# EAGLE design Driver_Led_final (EAGLE 9.6.2)
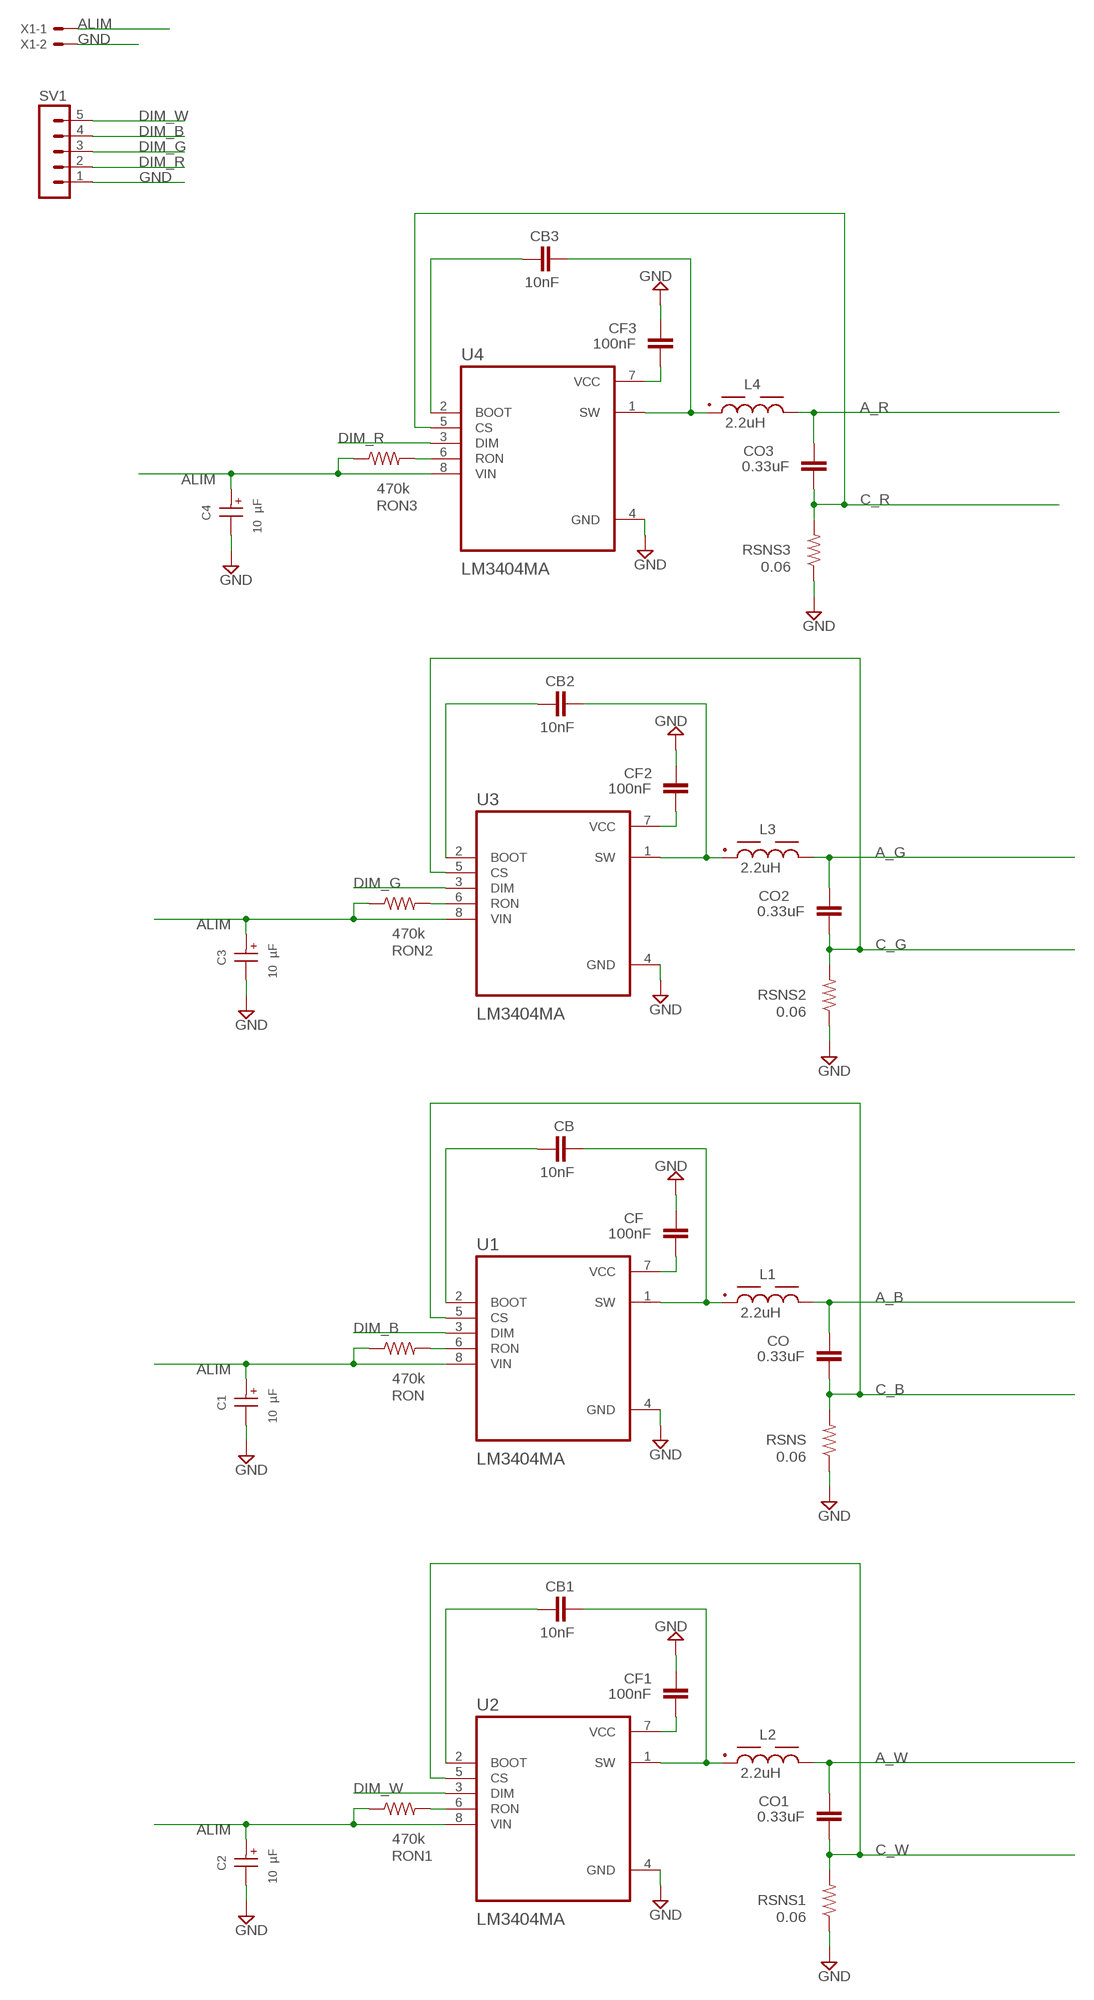
[diagram p0: schematic, sheet 1, part 1 of 2]
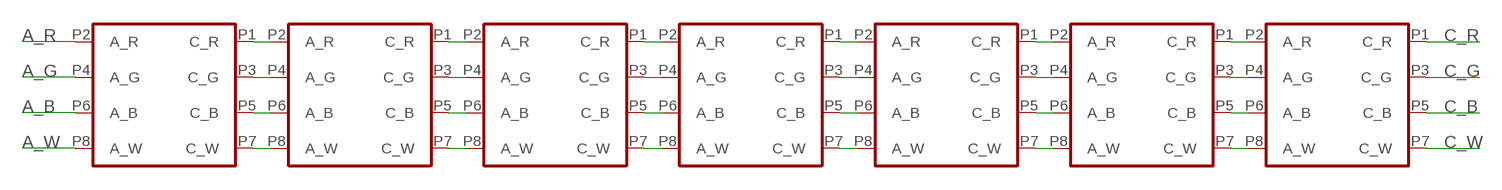
[diagram p1: schematic, sheet 1, part 2 of 2]

## Parts
C1  10 µF  WCAP-ASLL_4X5.5_865060440001  [WCAP-ASLL_4X5.5(DXL)]
C2  10 µF  WCAP-ASLL_4X5.5_865060440001  [WCAP-ASLL_4X5.5(DXL)]
C3  10 µF  WCAP-ASLL_4X5.5_865060440001  [WCAP-ASLL_4X5.5(DXL)]
C4  10 µF  WCAP-ASLL_4X5.5_865060440001  [WCAP-ASLL_4X5.5(DXL)]
CB  10nF  C-EUC0603  [C0603]
CB1  10nF  C-EUC0603  [C0603]
CB2  10nF  C-EUC0603  [C0603]
CB3  10nF  C-EUC0603  [C0603]
CF  100nF  C-EUC0603  [C0603]
CF1  100nF  C-EUC0603  [C0603]
CF2  100nF  C-EUC0603  [C0603]
CF3  100nF  C-EUC0603  [C0603]
CO  0.33uF  C-EUC0603  [C0603]
CO1  0.33uF  C-EUC0603  [C0603]
CO2  0.33uF  C-EUC0603  [C0603]
CO3  0.33uF  C-EUC0603  [C0603]
L1  2.2uH  WE-PDA_1260_784771022  [WE-PDA_1260]
L2  2.2uH  WE-PDA_1260_784771022  [WE-PDA_1260]
L3  2.2uH  WE-PDA_1260_784771022  [WE-PDA_1260]
L4  2.2uH  WE-PDA_1260_784771022  [WE-PDA_1260]
RON  470k  R-US_R0603  [R0603]
RON1  470k  R-US_R0603  [R0603]
RON2  470k  R-US_R0603  [R0603]
RON3  470k  R-US_R0603  [R0603]
RSNS  0.06  R-US_R0603  [R0603]
RSNS1  0.06  R-US_R0603  [R0603]
RSNS2  0.06  R-US_R0603  [R0603]
RSNS3  0.06  R-US_R0603  [R0603]
SV1  MA05-1  [MA05-1]
U1  LM3404MA  [SOIC127P599X175-8N]
U2  LM3404MA  [SOIC127P599X175-8N]
U3  LM3404MA  [SOIC127P599X175-8N]
U4  LM3404MA  [SOIC127P599X175-8N]
U$1  LE_RTDUW_S2WM_DEVICE  [LE_RTDUW_S2WM_FOOTPRINT]
U$2  LE_RTDUW_S2WM_DEVICE  [LE_RTDUW_S2WM_FOOTPRINT]
U$3  LE_RTDUW_S2WM_DEVICE  [LE_RTDUW_S2WM_FOOTPRINT]
U$4  LE_RTDUW_S2WM_DEVICE  [LE_RTDUW_S2WM_FOOTPRINT]
U$5  LE_RTDUW_S2WM_DEVICE  [LE_RTDUW_S2WM_FOOTPRINT]
U$6  LE_RTDUW_S2WM_DEVICE  [LE_RTDUW_S2WM_FOOTPRINT]
U$7  LE_RTDUW_S2WM_DEVICE  [LE_RTDUW_S2WM_FOOTPRINT]
X1  22-23-2021  [22-23-2021]

## Nets
A_B: CO.2 L1.2 U$1.P6(A_B)
A_G: CO2.2 L3.2 U$1.P4(A_G)
A_R: CO3.2 L4.2 U$1.P2(A_R)
A_W: CO1.2 L2.2 U$1.P8(A_W)
ALIM: C1.1(+) C2.1(+) C3.1(+) C4.1(+) RON1.1 RON2.1 RON3.1 RON.1 U1.8(VIN) U2.8(VIN) U3.8(VIN) U4.8(VIN) X1.1
C_B: CO.1 RSNS.2 U1.5(CS) U$7.P5(C_B)
C_G: CO2.1 RSNS2.2 U3.5(CS) U$7.P3(C_G)
C_R: CO3.1 RSNS3.2 U4.5(CS) U$7.P1(C_R)
C_W: CO1.1 RSNS1.2 U2.5(CS) U$7.P7(C_W)
DIM_B: SV1.4 U1.3(DIM)
DIM_G: SV1.3 U3.3(DIM)
DIM_R: SV1.2 U4.3(DIM)
DIM_W: SV1.5 U2.3(DIM)
GND: C1.2(-) C2.2(-) C3.2(-) C4.2(-) CF1.1 CF2.1 CF3.1 CF.1 RSNS1.1 RSNS2.1 RSNS3.1 RSNS.1 SV1.1 U1.4(GND) U2.4(GND) U3.4(GND) U4.4(GND) X1.2
N$1: RON.2 U1.6(RON)
N$2: CB1.1 U2.2(BOOT)
N$3: CF.2 U1.7(VCC)
N$4: CB.1 U1.2(BOOT)
N$5: CB.2 L1.1 U1.1(SW)
N$6: CB1.2 L2.1 U2.1(SW)
N$7: CF1.2 U2.7(VCC)
N$8: RON1.2 U2.6(RON)
N$9: CB2.1 U3.2(BOOT)
N$10: CB2.2 L3.1 U3.1(SW)
N$11: CF2.2 U3.7(VCC)
N$12: RON2.2 U3.6(RON)
N$13: CB3.1 U4.2(BOOT)
N$14: CB3.2 L4.1 U4.1(SW)
N$15: CF3.2 U4.7(VCC)
N$16: RON3.2 U4.6(RON)
N$17: U$1.P1(C_R) U$2.P2(A_R)
N$18: U$1.P3(C_G) U$2.P4(A_G)
N$19: U$1.P5(C_B) U$2.P6(A_B)
N$20: U$1.P7(C_W) U$2.P8(A_W)
N$21: U$2.P1(C_R) U$3.P2(A_R)
N$22: U$2.P3(C_G) U$3.P4(A_G)
N$23: U$2.P5(C_B) U$3.P6(A_B)
N$24: U$2.P7(C_W) U$3.P8(A_W)
N$25: U$3.P7(C_W) U$4.P8(A_W)
N$26: U$3.P5(C_B) U$4.P6(A_B)
N$27: U$3.P3(C_G) U$4.P4(A_G)
N$28: U$3.P1(C_R) U$4.P2(A_R)
N$29: U$4.P1(C_R) U$5.P2(A_R)
N$30: U$4.P3(C_G) U$5.P4(A_G)
N$31: U$4.P5(C_B) U$5.P6(A_B)
N$32: U$4.P7(C_W) U$5.P8(A_W)
N$33: U$5.P1(C_R) U$6.P2(A_R)
N$34: U$5.P3(C_G) U$6.P4(A_G)
N$35: U$5.P5(C_B) U$6.P6(A_B)
N$36: U$5.P7(C_W) U$6.P8(A_W)
N$37: U$6.P1(C_R) U$7.P2(A_R)
N$38: U$6.P3(C_G) U$7.P4(A_G)
N$39: U$6.P5(C_B) U$7.P6(A_B)
N$40: U$6.P7(C_W) U$7.P8(A_W)

## Library data of the parts
C1-C4 = Eagle_WCAP-ASLL (rev20a):WCAP-ASLL_4X5.5: WCAP-ASLL Aluminium Electrolytic Capacitors Low Impedance & Long Life +105 °C Characteristics Low impedance and long life product series Mounting style: V-Chip SMT Capacitance range: 1 µF ‒ 6800 µF Capacitance tolerance: ±20 % Voltage range (UR): 6.3 ‒ 450 V(DC) Operating temperature: -55 °C up to +105 °C for UR ≤ 100 V(DC) -40 °C up to +105 °C for UR > 100 V(DC) Endurance: 2000 ‒ 5000 h @ +105 °C Dimensions (DxL) in mm: 4.0 x 5.5 up to 16.0 x 17.0 Recommended soldering: Reflow soldering Applications Long life application & low impedance Input and output capacitor for switched-mode power supply Filtering Smoothing e.g. DC/DC converter, AC/DC converter, satellite receiver, control panel <https://www.we-online.com/catalog/media/o14724v209%20Family_WCAP-ASLL.jpg> Details see: https://www.we-online.com/catalog/en/WCAP-ASLL/ Updated by yingchun,Shan;2020-03-03 2020(C) Würth Elektronik; DATASHEET-URL: https://www.we-online.com/catalog/datasheet/865060440001.pdf; DF: 14%; DIAMETER: 4mm; I-LEAK: 3uA; I-RIPPLE: 90mA; L: 5.5mm; OPERATING-TEMPERATURE: -55 °C up to +105 °C; PART-NUMBER: 865060440001; TECHNICAL-REFERENCE: ASEB055100M025DVCTAB000; VR: 25V(DC); Z: 1.35Ohm
CB CB1-CB3 CF CF1-CF3 CO CO1-CO3 = rcl:C-EU: CAPACITOR, European symbol; SPICEPREFIX: C
L1-L4 = Eagle_WE-PDA (rev20b):WE-PDA_1260: WE-PDA SMD Shielded Power Inductor Characteristics Magnetically shielded version which results in a low leakage field High storage capacity High Saturation currents up to 23 A Very low self-losses at high switching frequency's Wide inductance spectrum available at all sizes Operating Temperature -40 °C up to +125 °C Core Material: NiZn Wire connection: welding technology Applications Multimedia applications Switching regulators with low operating voltages Integrated DC/DC-converter Perfect suitable for switching regulators with extremely high efficiency (> 86 %) Plastic base: Because of the one piece construction these are more suitable for high vibration or shock applications <https://www.we-online.com/catalog/media/o55118v209%20Family_WE-PDA.jpg> Details see: https://www.we-online.com/katalog/en/WE-PDA Updated by Ella Wu 2020-03-18 2020(C) Wurth Elektronik; DATASHEET-URL: https://www.we-online.com/catalog/datasheet/784771022.pdf; FRES: 82.7MHz; IR: 7.2A; ISAT: 10.5A; MOUNT: SMT; PART-NUMBER: 784771022; RDC-MAX: 12.5mOhm; RDC-TYP: 10.5mOhm
RON RON1-RON3 RSNS RSNS1-RSNS3 = rcl:R-US_: RESISTOR, American symbol; SPICEPREFIX: R
SV1 = con-lstb:MA05-1: PIN HEADER; OC_FARNELL: unknown; OC_NEWARK: unknown
U1-U4 = LM3404MA:LM3404MA: Check availability <https://pricing.snapeda.com/parts/LM3404MA/NOPB/Texas%20Instruments/view-part?ref=eda>; AVAILABILITY: In Stock; DESCRIPTION: 42-V 1.0-A constant current buck LED driver; MF: Texas Instruments; MP: LM3404MA/NOPB; PACKAGE: SOIC-8 Texas Instruments; PRICE: None; PURCHASE-URL: https://pricing.snapeda.com/search/part/LM3404MA/NOPB/?ref=eda
U$1-U$7 = Custom_LED:LE_RTDUW_S2WM_DEVICE
X1 = con-molex:22-23-2021: .100" (2.54mm) Center Header - 2 Pin; MF: MOLEX; MPN: 22-23-2021; OC_FARNELL: 1462926; OC_NEWARK: 25C3832

## Board
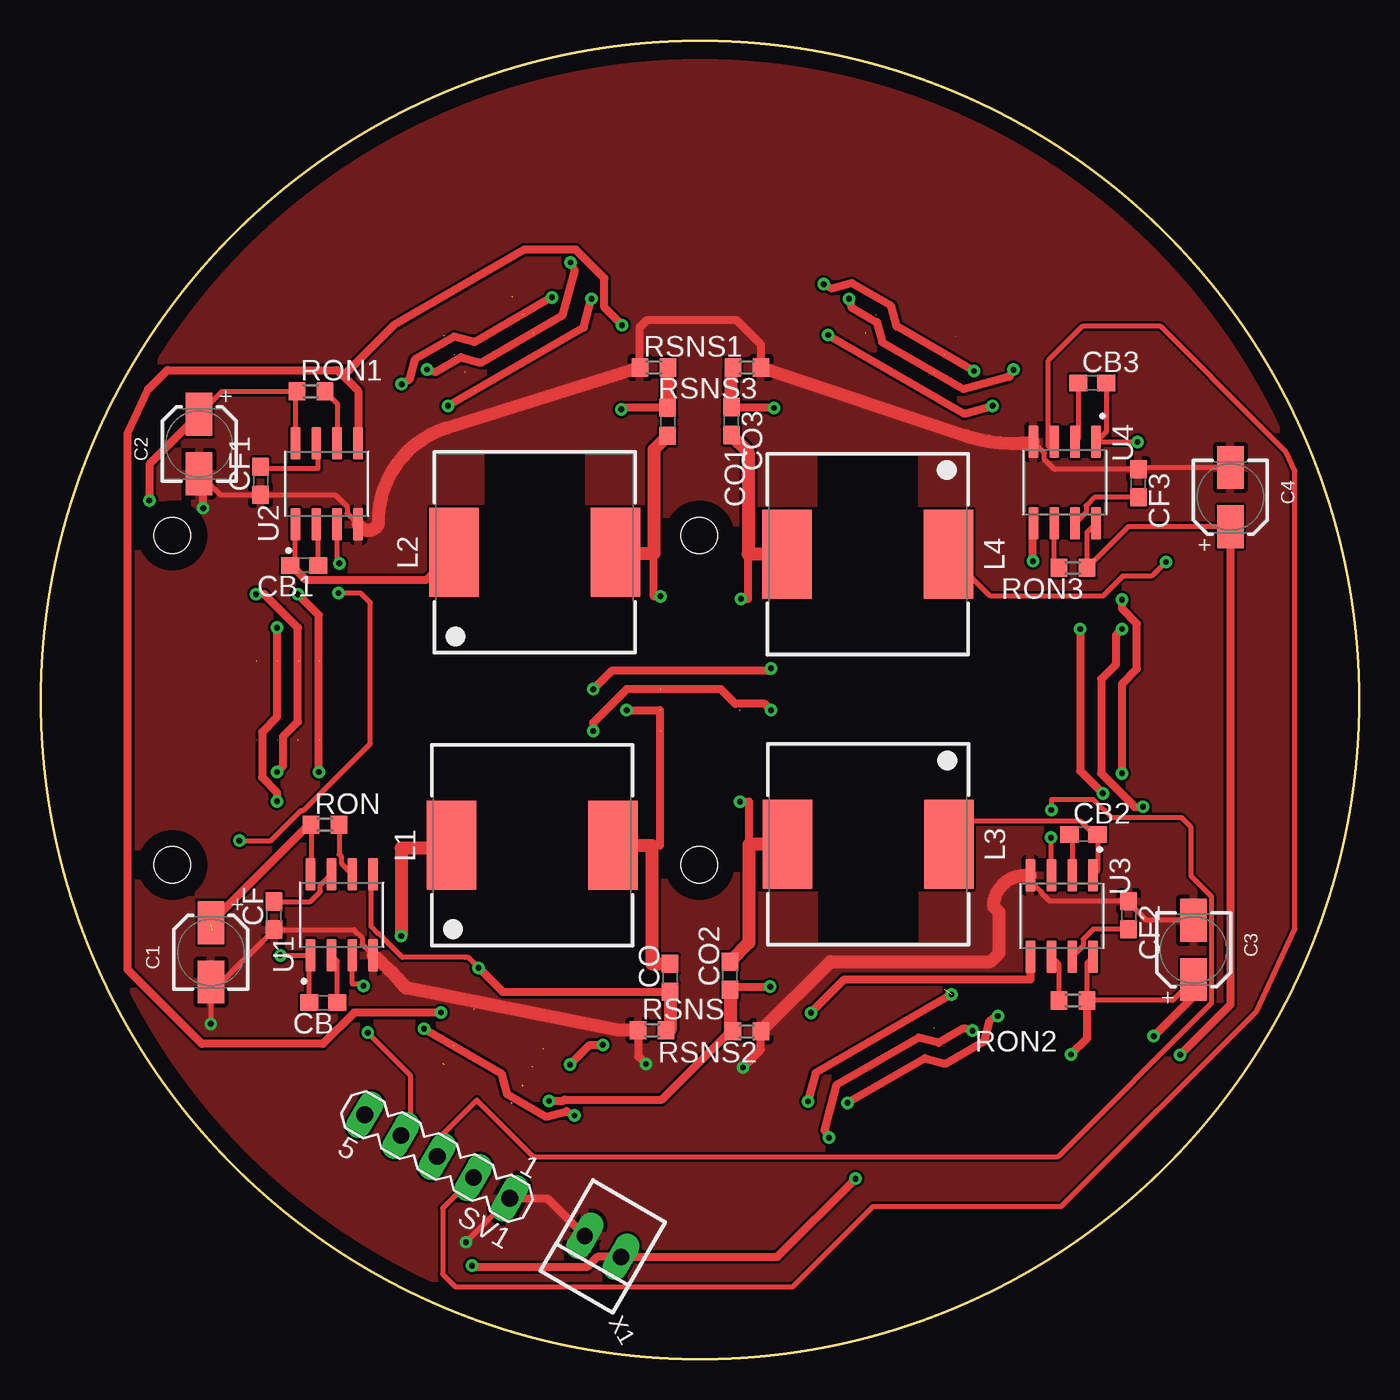
[diagram p2: board, top side]
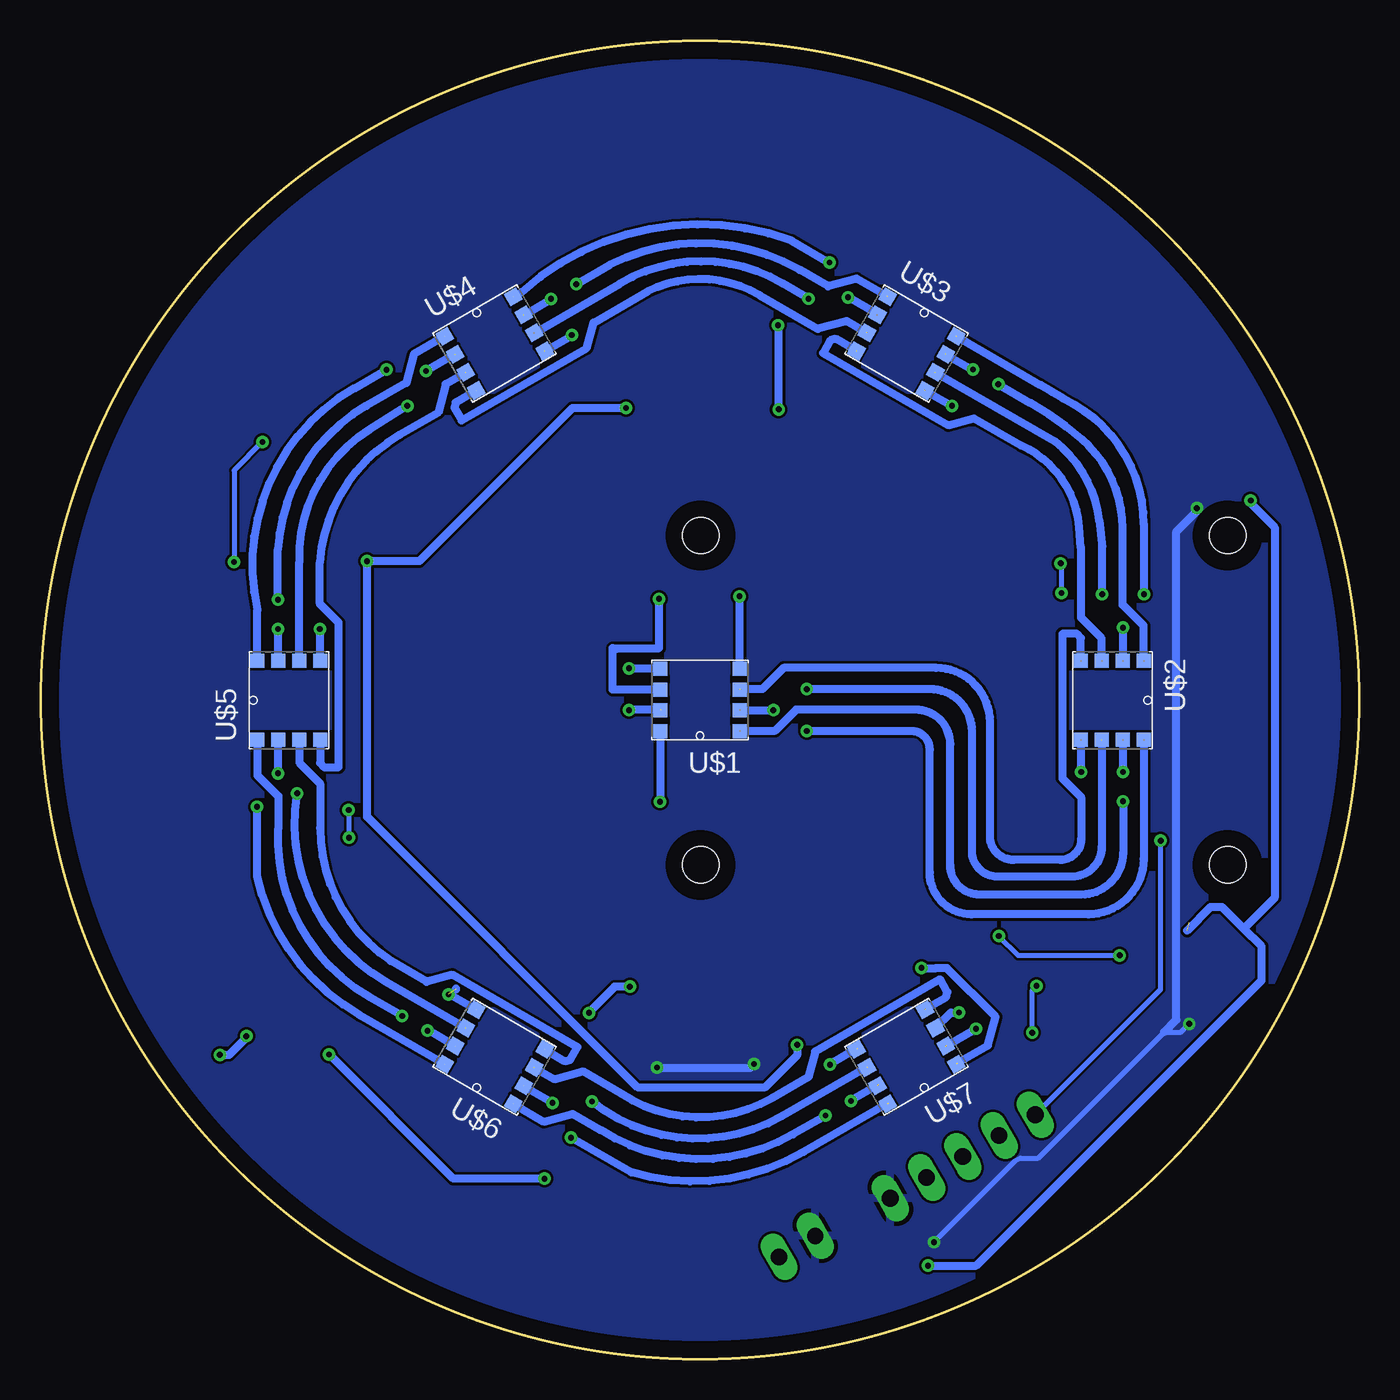
[diagram p3: board, bottom side, seen from below]

Size 80 x 80 mm. Coordinates in mm from the lower left corner, seen from the top.
Outline: circle at 40,40 radius 40
Copper layers (1*16): Top 0.035mm / dielectric 1.5mm / Bottom 0.035mm
Design rules "default": minimum track width 6mil, minimum drill 0.35mm, track to track 6mil, track to pad 6mil, pad to pad 6mil, via to via 6mil, smd to smd 6mil, copper to edge 40mil, drill to drill 6mil, minimum pad ring 10mil, minimum via ring 8mil, stop-mask expansion 4mil, vias tented up to drill 0mil, thermal gap 10mil
Holes 2.2 mm at 7.96,49.99 39.96,49.99 39.96,29.99 7.96,29.99

### Footprints (pad centres in the part's own frame; a part is rotated, then mirrored left to right if it is on the bottom)
WCAP-ASLL_4X5.5(DXL) = smd 2.6 x 1.6: 1 1.8,0; 2 -1.8,0
C0603 = smd 1.1 x 1: 1 -0.85,0; 2 0.85,0
WE-PDA_1260 = smd 5.4 x 3: 1 0,4.9; 2 0,-4.9
R0603 = smd 1 x 1.1: 1 -0.85,0; 2 0.85,0
MA05-1 = drill 1.016 long: 1 -5.08,0; 2 -2.54,0; 3 0,0; 4 2.54,0; 5 5.08,0
SOIC127P599X175-8N = smd 1.97 x 0.6: 1 -2.47,1.905; 2 -2.47,0.635; 3 -2.47,-0.635; 4 -2.47,-1.905; 5 2.47,-1.905; 6 2.47,-0.635; 7 2.47,0.635; 8 2.47,1.905
LE_RTDUW_S2WM_FOOTPRINT = smd 0.85 x 0.85: P1 2.4,-1.905; P2 2.4,-0.635; P3 2.4,0.635; P4 2.4,1.905; P5 -2.4,1.905; P6 -2.4,0.635; P7 -2.4,-0.635; P8 -2.4,-1.905
22-23-2021 = drill 1 long: 1 -1.27,0; 2 1.27,0

### Placement (x,y rotation side)
C1  10.3,24.68 90 top
C2  9.59,55.54 90 top
C3  69.97,24.83 270 top
C4  72.2,52.31 270 top
CB  17.13,21.63 180 top
CB1  15.97,48.17 180 top
CB2  63.29,31.84 0 top
CB3  63.82,59.25 0 top
CF  14.14,26.91 90 top
CF1  13.32,53.3 90 top
CF2  66.03,26.94 270 top
CF3  66.61,53.15 270 top
CO  38.19,23.13 90 top
CO1  38.04,56.89 270 top
CO2  41.82,23.26 90 top
CO3  41.9,56.94 270 top
L1  29.81,31.18 90 top
L2  29.96,48.96 90 top
L3  50.21,31.23 270 top
L4  50.18,48.86 270 top
RON  17.24,32.43 0 top
RON1  16.37,58.74 0 top
RON2  62.65,21.76 180 top
RON3  62.65,48.02 180 top
RSNS  37.1,19.95 0 top
RSNS1  37.2,60.19 0 top
RSNS2  42.84,19.88 180 top
RSNS3  42.84,60.19 180 top
SV1  24.04,12.28 150 top
U1  18.25,26.96 90 top
U2  17.34,53.13 90 top
U3  61.97,26.89 270 top
U4  62.14,53.2 270 top
U$1  40,40 180 bottom
U$2  14.96,39.99 270 bottom
U$3  27.46,61.64 330 bottom
U$4  52.46,61.64 30 bottom
U$5  64.96,39.99 90 bottom
U$6  52.46,18.34 150 bottom
U$7  27.46,18.34 210 bottom
X1  34.1,6.82 150 top

### Tracks (layer width: path | path; a pad name or v marks a point on that pad's centre or on a via)
A_B  (via drill 0.35)  (1 unrouted)
  Top 0.5: v35.55,39.39 37.56,39.39 37.56,31.18 37.07,31.18
  Top 0.8: L1.2 37.07,31.18 37.07,23.98 CO.2
  Bottom 0.5: 37.59,39.41 37.57,39.39 v35.55,39.39
A_G  (via drill 0.35)
  Top 0.5: v42.43,33.82 42.97,33.82 42.97,31.23
  Top 0.8: L3.2 42.97,31.23 42.97,25.25 CO2.2
  Bottom 0.5: U$1.P4 42.4,33.82 v42.43,33.82
A_R  (via drill 0.35)
  Top 0.5: v42.48,46.14 42.92,46.14 42.92,48.86
  Top 0.8: L4.2 42.92,48.86 42.92,55.07 CO3.2
  Bottom 0.5: U$1.P2 45.3,40.64 45.3,43.09 | 45.07,43.09 45.3,43.09 | 45.3,43.09 45.3,43.15 42.48,43.15 v42.48,46.14
A_W  (via drill 0.35)
  Top 0.5: v37.61,46.29 37.2,46.29 37.2,48.88
  Top 0.8: L2.2 34.94,48.88 37.2,48.88 37.2,55.2 CO1.2
  Bottom 0.5: U$1.P8 v37.6,46.29 v37.61,46.29
ALIM  (via drill 0.35)  (1 unrouted)
  Top 0.3: RON.1 16.39,29.47 U1.8 | U2.8 15.44,58.66 RON1.1 10.99,58.74 C2.1 | C4.1 65.99,50.51 RON3.1 63.5,50.19 U4.8 | C3.1 68.69,21.76 RON2.1 63.5,24.05 U3.8
  Top 0.5: C1.1 16.25,32.43 RON.1 | v49.44,10.94 44.69,6.19 X1.1 33.76,6.19 33.14,5.56 26.24,5.56 v26.15,5.65 | v62.52,18.48 63.5,19.46 RON2.1 | C2.1 6.56,54.31 v6.56,52.12 | C4.1 72.2,21.5 v69.15,18.46 | v67.54,19.59 69.97,22.01 C3.1
  Bottom 0.5: v49.44,10.94 54.98,10.94 v62.52,18.48 | v26.15,5.65 23.23,5.65 5.91,22.98 5.91,25.03 6.99,26.11 | 6.99,26.11 8.3,27.42 9.01,27.42 10.43,26 | v6.56,52.12 6.56,51.94 5.12,50.49 5.12,27.99 6.99,26.11 | v69.15,18.46 68.6,18.46 67.5,19.55 v67.54,19.59
C_B  (via drill 0.35)  (1 unrouted)
  Top 0.3: v26.55,23.74 25.92,24.37 25.75,24.37 21.94,24.37 20.76,25.55 20.76,25.56 20.54,25.78 20.5,25.78 20.03,26.25 20.03,29.31 U1.5
  Top 0.5: v26.55,23.74 28.01,22.28 CO.1
  Top 0.8: CO.1 38.19,19.95 RSNS.2
  Bottom 0.5: 24.39,17.94 22.52,19.02 22.06,20.76 25.01,23.72 25.66,23.72 25.66,23.71 26.53,23.71 v26.55,23.74
C_G  (via drill 0.35)  (1 unrouted)
  Top 0.5: v30.84,15.66 31.68,15.66 31.76,15.74 37.69,15.74 41.82,19.88 | CO2.1 42.01,22.6 v44.26,22.6 | v46.74,21.01 48.77,23.04 60.06,23.04 U3.5
  Top 0.8: CO2.1 41.82,19.88 RSNS2.2
  Bottom 0.5: 29.18,16.64 30.83,15.69 v30.84,15.66 | v44.26,22.6 45.18,22.6 46.75,21.02 v46.74,21.01
C_R  (via drill 0.35)  (1 unrouted)
  Top 0.5: v32.11,17.86 33.31,19.07 v34.1,19.07 | v60.21,48.43 60.21,50.71 U4.5 | CO3.1 44.43,57.79 v44.49,57.72
  Top 0.8: CO3.1 41.9,60.19 RSNS3.2
  Bottom 0.5: 30.45,18.84 32.1,17.89 v32.11,17.86 | v34.1,19.07 34.1,18.43 36.03,16.5 43.8,16.5 60.21,32.91 v60.21,48.43 57.04,48.43 47.74,57.72 v44.49,57.72
C_W  (via drill 0.35)
  Top 0.5: v24.27,21.02 18.99,21.02 17.1,19.13 9.76,19.13 5.25,23.64 5.25,56.19 6.5,58.87 7.66,60.04 17.97,60.04 18.33,59.68 | 18.33,59.68 19.24,58.77 U2.5 | CO1.1 35.31,57.74 v35.22,57.65 | v35.27,62.75 34.19,63.84 34.19,65.61 32.46,67.34 29.34,67.34 21.41,62.76 18.33,59.68
  Top 0.8: CO1.1 38.04,60.19 RSNS1.2
  Bottom 0.5: U$7.P7 24.77,21.02 v24.27,21.02 | v35.22,57.65 35.22,62.7 v35.27,62.75
DIM_B  (via drill 0.35)
  Top 0.3: SV1.4 22.4,14.11 22.4,17.23 v19.83,19.8 | v19.57,22.65 19.47,22.75 18.91,22.75 18.89,22.77 U1.3
  Bottom 0.3: v19.83,19.8 19.83,22.39 v19.57,22.65
DIM_G  (via drill 0.35)
  Top 0.3: SV1.3 24.04,13.3 26.45,15.7 29.86,12.28 61.75,12.28 71.07,21.61 71.07,28.06 69.81,29.31 69.81,32.27 69.25,32.84 64.99,32.84 63.87,33.95 61.33,33.95 v61.33,33.33 | v61.31,31.64 61.31,29.38 U3.3
  Bottom 0.3: v61.33,33.33 61.33,31.66 v61.31,31.64
DIM_R
  Top 0.3: SV1.2 24.37,9.14 24.37,5.15 25.15,4.37 45.62,4.37 50.51,9.26 61.94,9.26 73.8,21.12 76.11,26.09 76.11,53.91 75.58,55.06 74.36,56.28 74.16,56.48 67.96,62.68 63.21,62.68 61.16,60.62 61.16,55.39 61.23,55.39 U4.3
DIM_W  (via drill 0.35)
  Top 0.3: v12.03,31.46 13.94,31.46 15.76,33.28 15.9,33.28 19.98,37.35 19.98,45.91 19.4,46.49 v18.05,46.49 | v18.1,48.3 17.97,48.43 U2.3
  Bottom 0.3: SV1.5 12.03,22.44 v12.03,31.46 | v18.05,46.49 18.05,48.25 v18.1,48.3
GND  (via drill 0.35)
  Top 0.3: U1.4 19.49,25.16 19.49,25.56 18.99,26.06 CF.1 10.95,22.88 C1.2 v10.29,20.34 | U2.4 18.58,51.32 18.58,51.72 17.84,52.46 CF1.1 10.88,52.46 C2.2 | U4.4 60.91,55.01 60.91,54.61 61.51,54 CF3.1 66.73,54.11 C4.2 | 59.74,29.36 60.73,28.37 60.73,28.29 61.23,27.79 65.93,27.79 | CF2.1 65.93,27.79 | C3.2 67.09,26.63 65.93,27.79 | SV1.1 25.8,7.1 v25.8,7.08
  Top 0.5: SV1.1 30.72,9.74 X1.2 | RSNS1.1 36.35,62.64 36.79,63.08 42.2,63.08 43.69,61.6 RSNS3.1 | v9.84,51.65 9.84,53.49 C2.2 | RSNS.1 36.25,18.37 v36.72,17.9 | v42.61,17.69 43.69,18.77 RSNS2.1
  Top 0.8: RSNS3.1 56.12,56.05 arc26 U4.4 | RSNS1.1 24.63,56.52 arc74 20.46,50.66 20.46,50.66 arc-124 U2.4 | U3.4 59.74,29.36 arc90 57.83,27.45 58.16,27.12 58.16,24.63 57.65,24.12 47.93,24.12 RSNS2.1 | RSNS.1 35.03,19.95 22.14,22.52 arc13 U1.4
  Bottom 0.3: v25.8,7.08 20.86,12.01 20.55,12.19 19.47,12.19 11.83,19.83 10.8,19.83 v10.29,20.34
  Bottom 0.5: v9.84,51.65 9.84,51.46 11.08,50.22 11.08,20.58 11.83,19.83 | v36.72,17.9 36.97,17.64 42.61,17.64 v42.61,17.69
  pour Top: 38.9,83.71 83.1,83.71 83.1,-2.73 -1.56,-2.73 -1.56,-1.36 -1.56,83.71 38.85,83.71
  pour Bottom: -1.05,83.18 82.31,83.18 82.31,-1.41 -0.44,-1.41 -0.44,83.15 -1.05,83.15
N$1
  Top 0.3: RON.2 18.09,30.64 18.22,30.5 18.22,30.1 U1.6
N$2
  Top 0.3: CB1.1 16.82,50.54 U2.2
N$3
  Top 0.3: U1.7 16.95,28.77 16.95,28.37 16.35,27.76 CF.2
N$4
  Top 0.3: CB.1 17.98,24.13 U1.2
N$5  (via drill 0.35)
  Top 0.3: CB.2 16.28,24.43 U1.1 v14.52,24.5
  Top 0.8: L1.1 24.73,31 21.86,31 v21.86,25.67
  Bottom 0.3: v21.86,25.67 20.69,24.5 v14.52,24.5
N$6
  Top 0.3: CB1.2 15.43,48.49 U2.1
  Top 0.5: CB1.2 15.2,48.17 16.1,47.27 23.37,47.27 L2.1
N$7
  Top 0.3: U2.7 16.8,55.5 16.8,54.05 13.43,54.05 CF1.2
N$8
  Top 0.3: U2.6 17.98,57.98 RON1.2
N$9
  Top 0.3: CB2.1 62.6,31.68 U3.2
N$10
  Top 0.3: U3.1 64.14,29.62 CB2.2 63.91,31.84 63.11,32.64 56.52,32.64 L3.1
N$11
  Top 0.3: U3.7 63.27,25.09 63.27,25.49 63.87,26.09 CF2.2
N$12
  Top 0.3: RON2.2 61.8,23.95 U3.6
N$13
  Top 0.3: CB3.1 62.97,55.86 U4.2
N$14  (via drill 0.35)
  Top 0.3: CB3.2 64.67,56.29 U4.1 v66.56,55.67 | v68.29,48.38 67.43,47.51 65.67,47.51 64.46,46.3 57.63,46.3 L4.1
  Bottom 0.3: v66.56,55.67 68.29,53.94 v68.29,48.38
N$15
  Top 0.3: U4.7 63.45,51.4 63.45,51.8 63.95,52.3 CF3.2
N$16
  Top 0.3: RON3.2 61.51,48.31 U4.6
N$17  (via drill 0.35)  (1 unrouted)
  Top 0.5: v44.31,41.93 44.16,41.77 34.64,41.77 v33.52,40.66
  Bottom 0.5: 44.29,41.9 v44.31,41.93 42.4,41.93 U$1.P1 | 15.61,37.55 15.61,31.08 arc90 17.41,29.28 21.94,29.28 arc90 23.48,30.83 23.48,38.12 arc-90 26.02,40.66 v33.52,40.66
N$18  (via drill 0.35)  (2 unrouted)
  Top 0.5: v44.31,39.39 43.93,39.77 42.15,39.77 41.26,40.66 35.55,40.66 33.52,38.62 v33.52,38.12
  Bottom 0.5: 42.39,39.41 44.29,39.41 v44.31,39.39 | 13.07,37.55 13.07,30.34 arc90 16.42,26.99 23.51,26.99 arc90 26.05,29.53 26.05,37 arc-90 27.17,38.12 v33.52,38.12
N$19  (via drill 0.35)  (2 unrouted)
  Top 0.5: v14.32,44.39 14.32,38.96 13.41,38.05 13.41,35.3 14.32,34.4 v14.32,33.85
  Bottom 0.5: 37.59,38.14 35.43,38.14 34.16,39.41 26.89,39.41 arc90 24.81,37.33 24.81,29.96 arc-90 23.03,28.18 16.86,28.18 arc-90 14.32,30.72 v14.32,33.85 | 14.34,42.35 14.32,42.37 v14.32,44.39
N$20  (2 unrouted)
  Bottom 0.5: 37.59,40.68 36.19,40.68 34.92,41.95 25.67,41.95 arc90 22.39,38.67 22.39,31.72 arc-90 20.97,30.29 18.13,30.29 arc-90 16.86,31.56 16.86,34.1 18,35.25 18,44.01 17.11,44.01 16.88,43.78 16.88,42.35
N$21  (via drill 0.35)  (2 unrouted)
  Top 0.5: v16.86,35.63 16.86,45.15 v15.59,46.42
  Bottom 0.5: 25.74,59.9 18.46,55.7 arc46 15.77,50.91 15.59,49.26 v15.59,46.42 | 16.88,37.55 16.88,35.65 v16.86,35.63
N$22  (via drill 0.35)  (2 unrouted)
  Top 0.5: v14.32,35.63 14.7,36.01 14.7,37.79 15.59,38.67 15.59,44.39 13.55,46.42 v13.05,46.42
  Bottom 0.5: 24.47,62.1 19.3,59.12 arc-2 17.29,57.93 arc60 13.05,50.65 v13.05,46.42 | 14.34,37.55 14.34,35.65 v14.32,35.63
N$23  (via drill 0.35)  (2 unrouted)
  Top 0.5: v31.01,64.44 26.31,61.73 25.07,62.06 22.69,60.69 22.36,59.45 v21.88,59.18
  Bottom 0.5: 29.26,63.4 29.27,63.44 v31.01,64.44 | v21.88,59.18 19.9,58.03 arc10 16.81,55.82 arc49 14.34,50.42 14.34,45.78 13.07,44.51 13.07,42.35
N$24  (2 unrouted)
  Bottom 0.5: 30.53,61.21 31.77,61.92 32.08,61.84 32.52,61.07 24.94,56.68 23.37,57.1 20.52,55.45 arc62 16.98,50.49 16.88,49.25 16.88,47.72 16.88,47.46 16.88,45.02 15.61,43.75 15.61,42.35
N$25  (2 unrouted)
  Bottom 0.5: 29.89,62.3 31.1,63 32.84,62.54 36.38,64.59 arc-56 43.19,64.81 46.46,62.92 46.88,61.36 54.47,56.98 54.91,57.75 54.83,58.06 53.59,58.77
N$26  (via drill 0.35)  (2 unrouted)
  Top 0.5: v56.64,59.98 51.94,62.69 51.61,63.93 49.23,65.3 47.99,64.97 v47.51,65.25
  Bottom 0.5: 28.62,64.5 30.49,65.58 32.23,65.12 33.95,66.11 arc-57 45.49,66.41 v47.51,65.25 | 54.86,60.97 54.9,60.98 v56.64,59.98
N$27  (via drill 0.35)  (2 unrouted)
  Top 0.5: v23.42,60.06 23.94,59.92 25.48,60.81 26.7,60.49 31.65,63.34 32.39,66.12 v32.14,66.56
  Bottom 0.5: 25.1,61 23.46,60.05 v23.42,60.06 | v32.14,66.56 34.44,67.89 arc-62 50.83,64.77 51.34,64.47
N$28  (via drill 0.35)  (2 unrouted)
  Top 0.5: v24.69,57.86 32.94,62.63 v33.41,64.36
  Bottom 0.5: 26.37,58.8 24.73,57.86 v24.69,57.86 | 50.07,62.27 44.87,65.28 arc61 34.99,65.29 v33.41,64.36
N$29  (via drill 0.35)  (1 unrouted)
  Top 0.5: v47.78,62.16 56.03,57.39 v57.77,57.86
  Bottom 0.5: U$5.P2 64.33,48.4 arc60 60.09,56.4 v57.77,57.86 | 49.44,61.17 47.79,62.12 v47.78,62.16
N$30  (via drill 0.35)  (1 unrouted)
  Top 0.5: v49.05,64.36 49.19,63.84 50.73,62.95 51.06,61.73 56.01,58.88 58.78,59.62 v59.04,60.06
  Bottom 0.5: U$5.P4 66.87,45.47 arc73 61.02,58.91 v59.04,60.06 | 50.71,63.37 49.06,64.32 v49.05,64.36
N$31  (via drill 0.35)  (1 unrouted)
  Top 0.5: v65.62,35.55 65.62,40.98 66.53,41.89 66.53,44.64 65.62,45.54 v65.62,46.09
  Bottom 0.5: U$5.P6 65.62,37.57 v65.62,35.55 | v65.62,46.09 65.62,49.16 arc57 60.26,57.86 57.83,59.26 57.37,60.99 55.5,62.07
N$32  (1 unrouted)
  Bottom 0.5: U$5.P8 63.06,36.16 62.83,35.93 61.94,35.93 61.94,44.69 63.08,45.84 63.08,48.38 arc56 58.24,56.09 55.9,57.44 55.44,59.18 54.23,59.87
N$33  (via drill 0.35)  (1 unrouted)
  Top 0.5: v63.08,44.31 63.08,35.7 v64.46,34.33
  Bottom 0.5: U$5.P1 63.06,44.29 v63.08,44.31 | U$6.P2 59.05,22.87 arc69 v64.46,34.33
N$34  (via drill 0.35)  (1 unrouted)
  Top 0.5: v65.62,44.31 65.24,43.93 65.24,42.15 64.35,41.27 64.35,35.55 66.39,33.52 v66.89,33.52
  Bottom 0.5: U$5.P3 65.6,44.29 v65.62,44.31 | v66.89,33.52 66.89,29.29 arc-47 60.66,20.87 U$6.P4
N$35  (via drill 0.35)  (1 unrouted)
  Top 0.5: v48.95,15.55 53.65,18.26 54.89,17.93 57.27,19.3 57.61,20.54 v58.08,20.82
  Bottom 0.5: U$5.P5 66.87,35.43 65.6,34.16 65.6,32.22 arc-63 60.06,21.96 v58.08,20.82 | U$6.P6 50.7,16.55 v48.95,15.55
N$36  (1 unrouted)
  Bottom 0.5: U$5.P7 64.33,36.19 63.06,34.92 63.06,32.22 arc-56 58.79,24.16 56.59,22.89 55.03,23.31 47.44,18.93 47.88,18.16 48.2,18.07 U$6.P8
N$37  (via drill 0.35)  (3 unrouted)
  Top 0.5: v55.27,22.13 47.02,17.36 v46.56,15.63
  Bottom 0.5: 54.83,22.43 54.83,22.47 | U$6.P1 55.24,22.14 v55.27,22.13 | 29.82,17.74 35.02,14.74 arc69 v46.56,15.63
N$38  (via drill 0.35)  (2 unrouted)
  Top 0.5: v56.54,19.93 56.02,20.07 54.48,19.18 53.27,19.5 48.32,16.65 47.57,13.87 v47.83,13.43
  Bottom 0.5: U$6.P3 56.51,19.94 v56.54,19.93 | v47.83,13.43 44.16,11.31 arc-46 33.71,12.56 28.55,15.54
N$39  (via drill 0.35)  (2 unrouted)
  Top 0.5: v23.25,20.04 27.95,17.33 28.28,16.09 30.66,14.71 31.9,15.04 v32.38,14.77
  Bottom 0.5: U$6.P5 49.47,14.41 47.74,14.87 46.06,13.9 arc-63 34.36,13.63 v32.38,14.77 | 25.03,19.04 24.99,19.03 v23.25,20.04
N$40  (2 unrouted)
  Bottom 0.5: U$6.P7 48.86,16.99 47.13,17.45 44.79,16.1 arc-63 35.63,15.83 33.43,17.1 33.01,18.66 25.42,23.04 24.97,22.27 25.06,21.96 26.3,21.24